# EAGLE design blinky-lights (EAGLE 6.3)
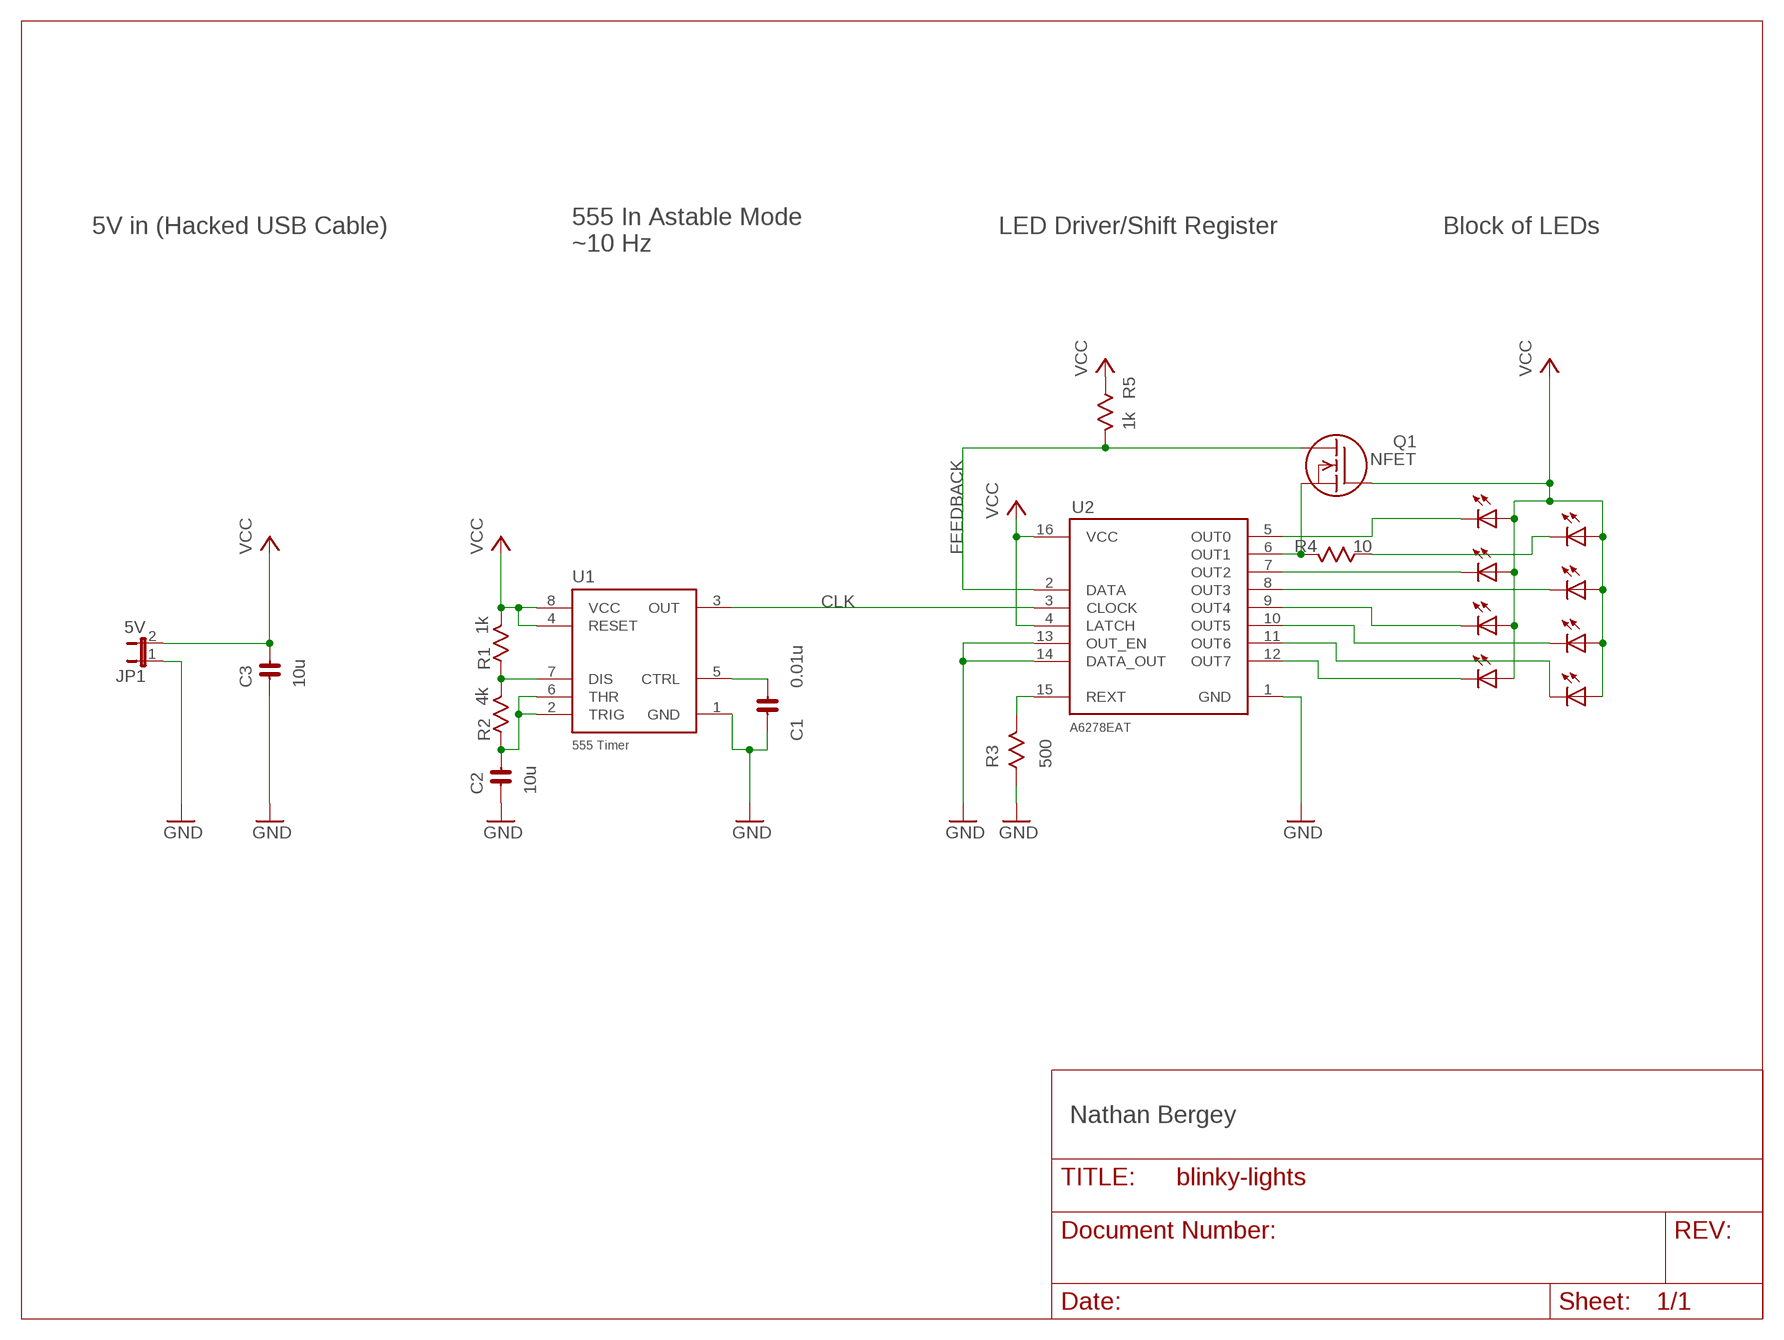
[diagram p0: schematic, sheet 1]

## Parts
C1  0.01u  CAP  [CAP]
C2  10u  CAP  [CAP]
C3  10u  CAP  [CAP]
JP1  5V  JP1E  [JP1]
LED0  LED3MM  [LED3MM]
LED1  LED3MM  [LED3MM]
LED2  LED3MM  [LED3MM]
LED3  LED3MM  [LED3MM]
LED4  LED3MM  [LED3MM]
LED5  LED3MM  [LED3MM]
LED6  LED3MM  [LED3MM]
LED7  LED3MM  [LED3MM]
Q1  NFET  [TO92-EBC]
R1  1k  RESISTOR  [V234/12]
R2  4k  RESISTOR  [V234/12]
R3  500  RESISTOR  [V234/12]
R4  10  RESISTOR  [V234/12]
R5  1k  RESISTOR  [V234/12]
U1  555  [555]
U2  A2678EAT  [A6278EAT]

## Nets
CLK: U1.3(OUT) U2.3(CLOCK)
FEEDBACK: Q1.D R5.2(C) U2.2(DATA)
GND: C1.C C2.C C3.C JP1.1 R3.1(A) U1.1(GND) U2.1(GND) U2.13(OUT_EN) U2.14(DATA_OUT)
N$1: LED0.K(C) U2.5(OUT0)
N$2: LED2.K(C) U2.7(OUT2)
N$3: LED4.K(C) U2.9(OUT4)
N$4: LED7.K(C) U2.12(OUT7)
N$5: Q1.S R4.2(C) U2.6(OUT1)
N$6: LED3.K(C) U2.8(OUT3)
N$7: LED5.K(C) U2.10(OUT5)
N$8: LED6.K(C) U2.11(OUT6)
N$9: R1.1(A) R2.2(C) U1.7(DIS)
N$10: C1.A U1.5(CTRL)
N$11: C2.A R2.1(A) U1.2(TRIG) U1.6(THR)
REXT: R3.2(C) U2.15(REXT)
SENSE: LED1.K(C) R4.1(A)
VCC: C3.A JP1.2 LED0.A LED1.A LED2.A LED3.A LED4.A LED5.A LED6.A LED7.A Q1.G R1.2(C) R5.1(A) U1.4(RESET) U1.8(VCC) U2.4(LATCH) U2.16(VCC)

## Notes on the sheet
- 5V in (Hacked USB Cable) | LED Driver/Shift Register | Block of LEDs
- 555 In Astable Mode
  ~10 Hz
- Nathan Bergey

## Library data of the parts
C1-C3 = blinky-lights:CAP
JP1 = blinky-lights:JP1E: JUMPER
LED0 LED1-LED7 = blinky-lights:LED3MM: 3mm LED
Q1 = blinky-lights:NFET
R1-R5 = blinky-lights:RESISTOR
U1 = blinky-lights:555: 555 Timer
U2 = blinky-lights:A2678EAT: Allegro A6278EAT Shift Register and LED Driver IC

## Board
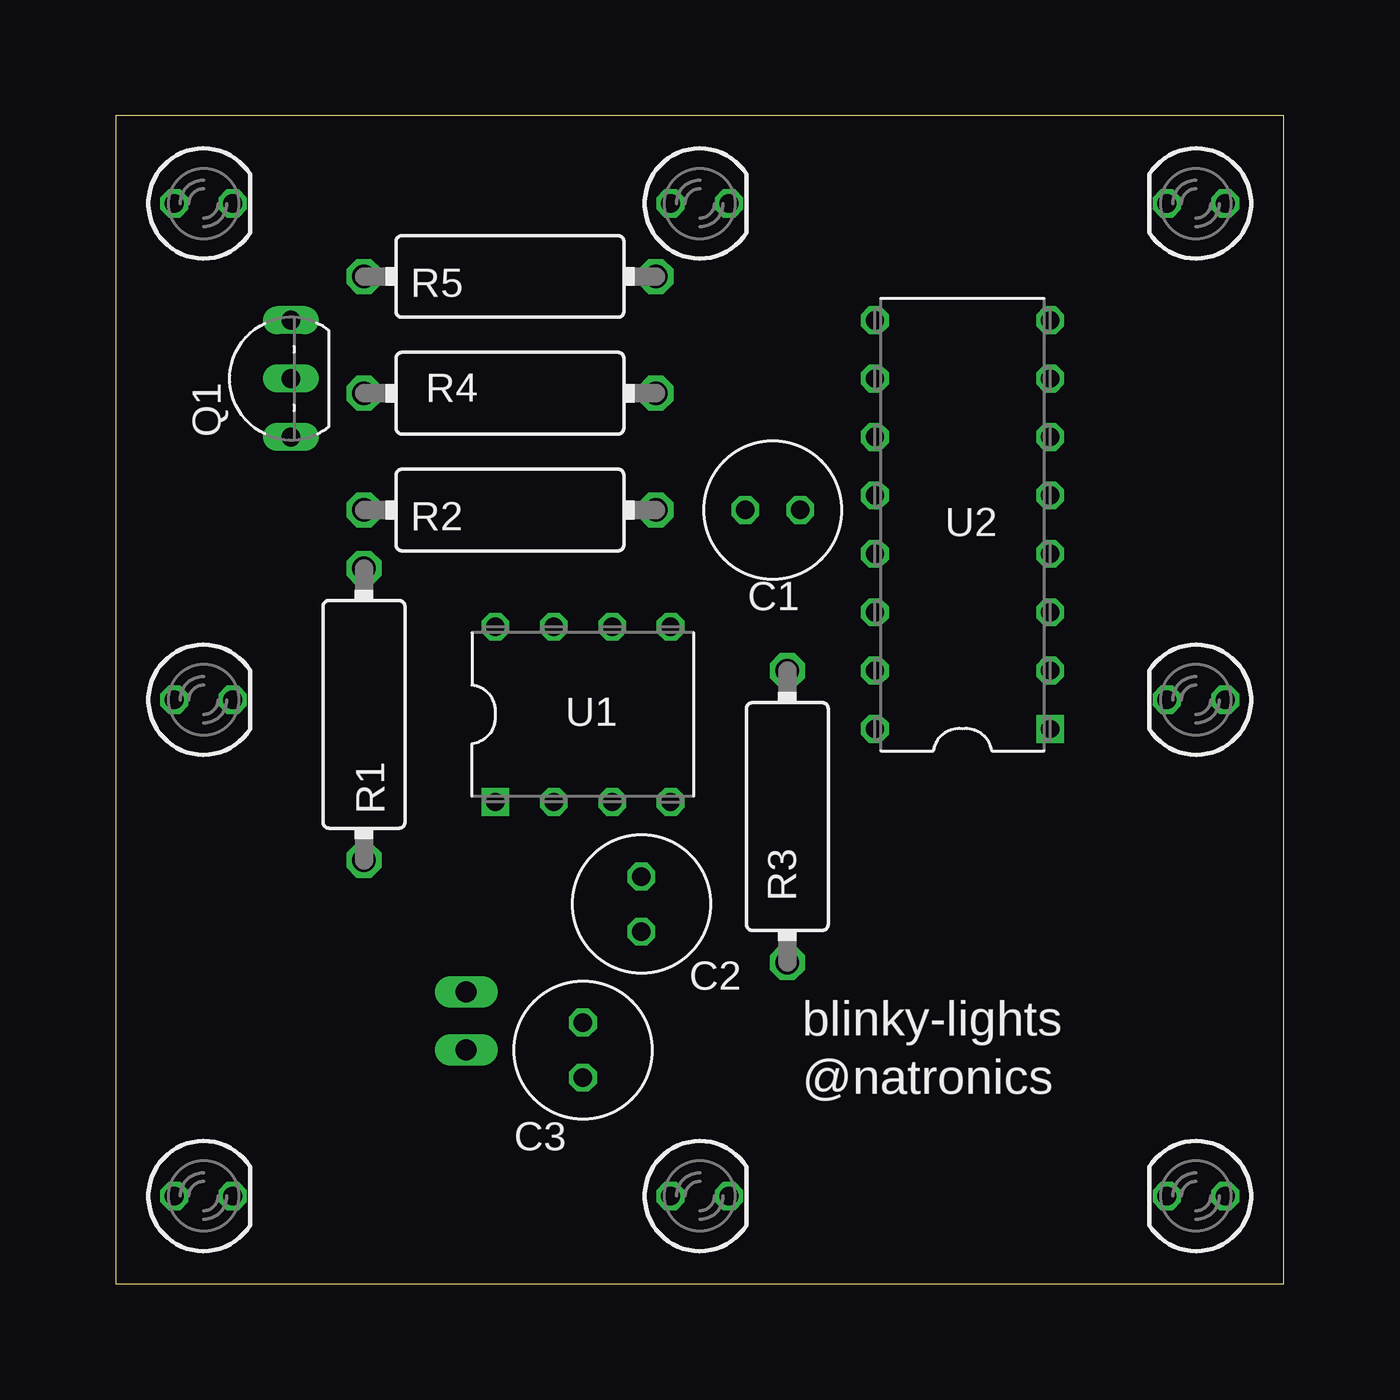
[diagram p1: board, top side]
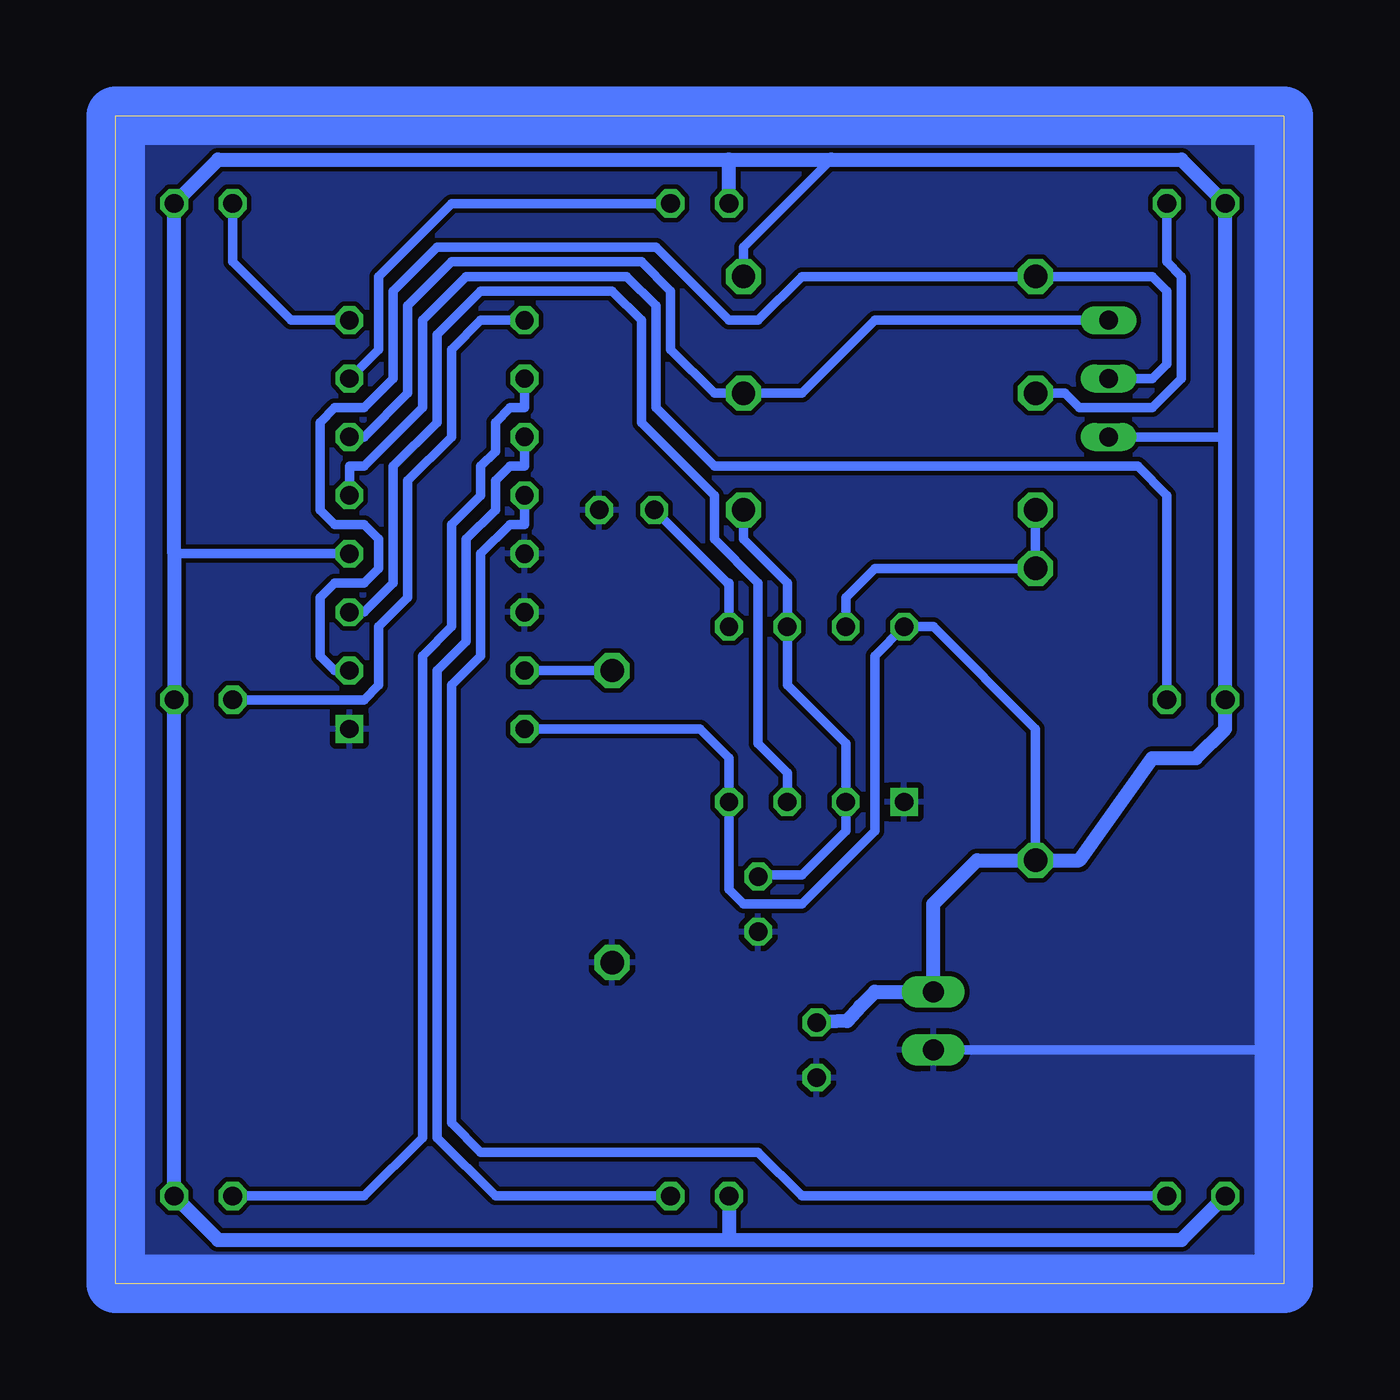
[diagram p2: board, bottom side, seen from below]

Size 50.8 x 50.8 mm. Coordinates in mm from the lower left corner, seen from the top.
Outline: 0,0 50.8,0 50.8,50.8 0,50.8 0,0
Copper layers (1*16): Top 0.0178mm / dielectric 59mil / Bottom 0.0178mm
Design rules "epl-lpkf": minimum track width 8mil, minimum drill 0.35mm, track to track 8mil, track to pad 8mil, pad to pad 8mil, via to via 8mil, smd to smd 8mil, copper to edge 15mil, drill to drill 15mil, minimum pad ring 8mil, minimum via ring 8mil, stop-mask expansion 3mil, vias tented up to drill 0mil, thermal gap 10mil

### Footprints (pad centres in the part's own frame; a part is rotated, then mirrored left to right if it is on the bottom)
CAP = drill 0.8 octagon: A -1.2,0; C 1.2,0
JP1 = drill 0.914 long: 1 0,-1.27; 2 0,1.27
LED3MM = drill 0.813 octagon: A -1.27,0; K 1.27,0
TO92-EBC = drill 0.813 long: D 0,-1.27; G -2.54,-1.27; S 2.54,-1.27
V234/12 = drill 1.016 octagon: 1 -6.35,0; 2 6.35,0
555 = drill 0.8 square: 1 -3.81,-3.81 | drill 0.8 octagon: 2 -1.27,-3.81; 3 1.27,-3.81; 4 3.81,-3.81; 5 3.81,3.81; 6 1.27,3.81; 7 -1.27,3.81; 8 -3.81,3.81
A6278EAT = drill 0.8 square: 1 -8.89,-3.81 | drill 0.8 octagon: 2 -6.35,-3.81; 3 -3.81,-3.81; 4 -1.27,-3.81; 5 1.27,-3.81; 6 3.81,-3.81; 7 6.35,-3.81; 8 8.89,-3.81; 9 8.89,3.81; 10 6.35,3.81; 11 3.81,3.81; 12 1.27,3.81; 13 -1.27,3.81; 14 -3.81,3.81; 15 -6.35,3.81; 16 -8.89,3.81

### Placement (x,y rotation side)
C1  28.57,33.66 0 top
C2  22.86,16.51 270 top
C3  20.32,10.16 270 top
JP1  15.24,11.43 0 top
LED0  3.81,25.4 0 top
LED1  3.81,46.99 0 top
LED2  25.4,46.99 0 top
LED3  46.99,46.99 180 top
LED4  46.99,25.4 180 top
LED5  46.99,3.81 180 top
LED6  25.4,3.81 0 top
LED7  3.81,3.81 0 top
Q1  6.35,39.37 90 top
R1  10.79,24.77 270 top
R2  17.14,33.66 180 top
R3  29.21,20.32 90 top
R4  17.14,38.73 0 top
R5  17.14,43.81 180 top
U1  20.32,24.77 0 top
U2  36.83,33.02 90 top

### Tracks (layer width: path | path; a pad name or v marks a point on that pad's centre or on a via)
CLK
  Bottom 0.406: U1.3 21.59,22.23 22.86,23.5 22.86,30.48 24.77,32.38 24.77,34.29 27.94,37.47 27.94,41.91 29.21,43.18 34.92,43.18 36.83,41.27 36.83,37.47 38.73,35.56 38.73,30.48 40.01,29.21 U2.3
FEEDBACK
  Bottom 0.406: U2.2 41.27,26.67 41.91,27.3 41.91,29.84 41.27,30.48 40.01,30.48 39.37,31.11 39.37,32.38 40.01,33.02 41.27,33.02 41.91,33.66 41.91,37.47 41.27,38.1 40.01,38.1 38.73,39.37 38.73,43.18 36.83,45.09 27.3,45.09 24.13,41.91 22.86,41.91 20.95,43.81 R5.2 5.71,43.81 5.08,43.18 5.08,40.01 5.71,39.37 Q1.D
GND
  Bottom 0.406: JP1.1 0,10.16
  Bottom 2.54: 0,0 0,10.16 0,50.8 50.8,50.8 50.8,0 0,0
  pour Bottom: 0,0 0,50.8 50.8,50.8 50.8,0
N$1
  Bottom 0.406: LED0.K 5.08,34.29 6.35,35.56 24.77,35.56 27.3,38.1 27.3,42.55 28.57,43.81 35.56,43.81 37.47,41.91 37.47,38.1 40.01,35.56 40.64,35.56 U2.5
N$2
  Bottom 0.406: LED2.K 36.2,46.99 39.37,43.81 39.37,40.64 U2.7
N$3
  Bottom 0.406: LED4.K 40.01,25.4 39.37,26.04 39.37,28.57 38.1,29.84 38.1,34.92 36.2,36.83 36.2,40.64 34.92,41.91 U2.9
N$4
  Bottom 0.406: U2.12 33.02,33.02 33.66,33.02 34.92,31.75 34.92,27.3 36.2,26.04 36.2,6.99 34.92,5.71 22.86,5.71 20.95,3.81 LED7.K
N$5
  Bottom 0.406: U2.6 40.01,36.83 38.1,38.73 38.1,42.55 36.2,44.45 27.94,44.45 26.67,43.18 26.67,40.64 24.77,38.73 R4.2 20.95,38.73 17.78,41.91 Q1.S
N$6
  Bottom 0.406: LED3.K 45.72,44.45 43.18,41.91 U2.8
N$7
  Bottom 0.406: U2.10 33.02,38.1 33.66,38.1 34.29,37.47 34.29,36.2 34.92,35.56 34.92,34.29 36.2,33.02 36.2,28.57 37.47,27.3 37.47,6.35 40.01,3.81 LED5.K
N$8
  Bottom 0.406: LED6.K 34.29,3.81 36.83,6.35 36.83,26.67 35.56,27.94 35.56,32.38 34.29,33.66 34.29,34.92 33.66,35.56 33.02,35.56 U2.11
N$9
  Bottom 0.406: R2.2 R1.1 17.78,31.11 19.05,29.84 U1.7
N$10
  Bottom 0.406: U1.5 24.13,30.48 24.2,30.48 C1.A
N$11
  Bottom 0.406: R2.1 23.5,32.38 21.59,30.48 U1.6 21.59,26.04 19.05,23.5 U1.2 19.05,19.68 20.95,17.78 22.79,17.78 C2.A
REXT
  Bottom 0.406: R3.2 U2.15
SENSE
  Bottom 0.406: R4.1 9.53,38.73 8.89,38.1 5.71,38.1 4.45,39.37 4.45,43.81 5.08,44.45 LED1.K
VCC
  Bottom 0.406: U2.4 48.26,31.75 | U2.16 25.4,24.13 24.13,22.86 U1.4 24.13,17.14 23.5,16.51 20.95,16.51 17.78,19.68 17.78,27.3 U1.8 15.24,28.57 10.79,24.13 R1.2 | Q1.G 2.54,36.83 | R5.1 23.5,45.09 19.68,48.9
  Bottom 0.61: LED7.A 4.45,1.91 24.13,1.91 | 24.13,1.91 46.35,1.91 LED5.A LED4.A 48.26,31.75 LED3.A 46.35,48.9 24.13,48.9 | 24.13,48.9 19.68,48.9 4.45,48.9 LED1.A 2.54,36.83 LED0.A 2.54,24.13 3.81,22.86 5.71,22.86 8.89,18.41 R1.2 13.34,18.41 15.24,16.51 JP1.2 17.78,12.7 18.41,12.06 18.98,11.43 C3.A | LED2.A 24.13,48.9 | LED6.A 24.13,1.91

### Text on the board
tPlace: blinky-lights | @natronics